# Altium schematic sheet LC BigOne - Comm Connectors.SchDoc
size A4; Version: ver; Variant: Variant; Modification: Mod; Project: Project Name
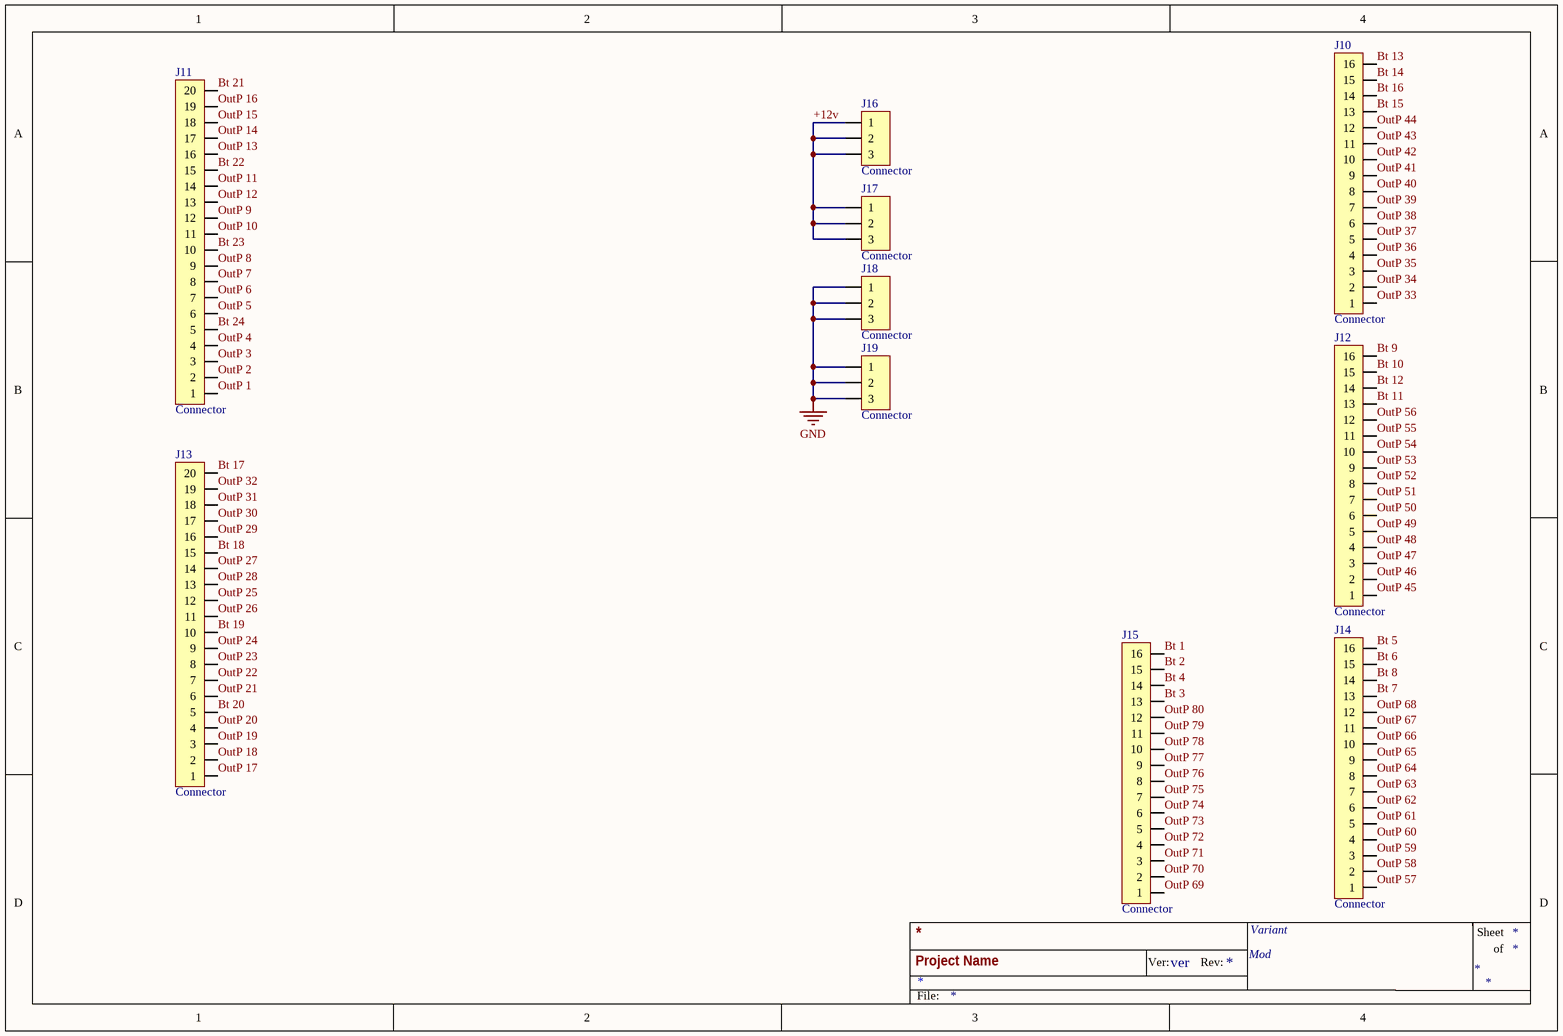
[diagram p0: LC BigOne - Comm Connectors.SchDoc]

## Parts
J10  Connector  [LINE 2.54 x 16D (2 x 8) BH]
J11  Connector  [LINE 2.54 x 20D (2 x 10) - BH]
J12  Connector  [LINE 2.54 x 16D (2 x 8) BH]
J13  Connector  [LINE 2.54 x 20D (2 x 10) - BH]
J14  Connector  [LINE 2.54 x 16D (2 x 8) BH]
J15  Connector  [LINE 2.54 x 16D (2 x 8) BH]
J16  Connector  [DG301 5mm 3p]
J17  Connector  [DG301 5mm 3p]
J18  Connector  [DG301 5mm 3p]
J19  Connector  [DG301 5mm 3p]

## Nets
GND: J18.1 J18.2 J18.3 J19.1 J19.2 J19.3
+12v: J16.1 J16.2 J16.3 J17.1 J17.2 J17.3
Bt 1: J15.16
Bt 2: J15.15
Bt 3: J15.13
Bt 4: J15.14
Bt 5: J14.16
Bt 6: J14.15
Bt 7: J14.13
Bt 8: J14.14
Bt 9: J12.16
Bt 10: J12.15
Bt 11: J12.13
Bt 12: J12.14
Bt 13: J10.16
Bt 14: J10.15
Bt 15: J10.13
Bt 16: J10.14
Bt 17: J13.20
Bt 18: J13.15
Bt 19: J13.10
Bt 20: J13.5
Bt 21: J11.20
Bt 22: J11.15
Bt 23: J11.10
Bt 24: J11.5
OutP 1: J11.1
OutP 2: J11.2
OutP 3: J11.3
OutP 4: J11.4
OutP 5: J11.6
OutP 6: J11.7
OutP 7: J11.8
OutP 8: J11.9
OutP 9: J11.12
OutP 10: J11.11
OutP 11: J11.14
OutP 12: J11.13
OutP 13: J11.16
OutP 14: J11.17
OutP 15: J11.18
OutP 16: J11.19
OutP 17: J13.1
OutP 18: J13.2
OutP 19: J13.3
OutP 20: J13.4
OutP 21: J13.6
OutP 22: J13.7
OutP 23: J13.8
OutP 24: J13.9
OutP 25: J13.12
OutP 26: J13.11
OutP 27: J13.14
OutP 28: J13.13
OutP 29: J13.16
OutP 30: J13.17
OutP 31: J13.18
OutP 32: J13.19
OutP 33: J10.1
OutP 34: J10.2
OutP 35: J10.3
OutP 36: J10.4
OutP 37: J10.5
OutP 38: J10.6
OutP 39: J10.7
OutP 40: J10.8
OutP 41: J10.9
OutP 42: J10.10
OutP 43: J10.11
OutP 44: J10.12
OutP 45: J12.1
OutP 46: J12.2
OutP 47: J12.3
OutP 48: J12.4
OutP 49: J12.5
OutP 50: J12.6
OutP 51: J12.7
OutP 52: J12.8
OutP 53: J12.9
OutP 54: J12.10
OutP 55: J12.11
OutP 56: J12.12
OutP 57: J14.1
OutP 58: J14.2
OutP 59: J14.3
OutP 60: J14.4
OutP 61: J14.5
OutP 62: J14.6
OutP 63: J14.7
OutP 64: J14.8
OutP 65: J14.9
OutP 66: J14.10
OutP 67: J14.11
OutP 68: J14.12
OutP 69: J15.1
OutP 70: J15.2
OutP 71: J15.3
OutP 72: J15.4
OutP 73: J15.5
OutP 74: J15.6
OutP 75: J15.7
OutP 76: J15.8
OutP 77: J15.9
OutP 78: J15.10
OutP 79: J15.11
OutP 80: J15.12

## Notes on the sheet
- Ver:
- Rev:
- Sheet
- of
- File:

## Library data of the parts
J10 J12 J14 J15 = PLD-16 (2 x 8): Vert, Dbl line, Male
J11 J13 = PLD-20 (2 x 10): Vert, Dbl line, Male
J16-J19 = DG301-5.0-3P12: DG301 series